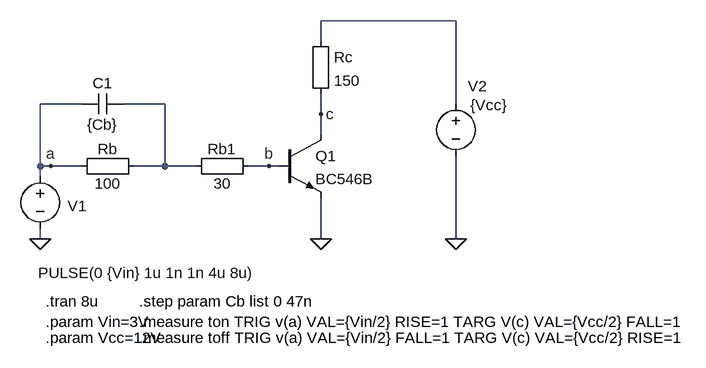
[diagram p0: schematic BJT-SWITCH-4.asc]
BJT-SWITCH-4.asc, the LTspice schematic file:
Version 4
SHEET 1 880 680
WIRE 416 -96 208 -96
WIRE 208 -64 208 -96
WIRE -160 32 -224 32
WIRE -32 32 -96 32
WIRE 416 32 416 -96
WIRE 208 48 208 16
WIRE 208 80 208 48
WIRE -224 128 -224 32
WIRE -208 128 -224 128
WIRE -160 128 -208 128
WIRE -32 128 -32 32
WIRE -32 128 -80 128
WIRE 16 128 -32 128
WIRE 128 128 96 128
WIRE 144 128 128 128
WIRE -224 144 -224 128
WIRE -224 240 -224 224
WIRE 208 240 208 176
WIRE 416 240 416 112
FLAG 208 240 0
FLAG -224 240 0
FLAG 416 240 0
FLAG -208 128 a
FLAG 208 48 c
FLAG 128 128 b
SYMBOL Misc\\EuropeanResistor 192 -80 R0
SYMATTR InstName Rc
SYMATTR Value 150
SYMBOL Misc\\EuropeanResistor -64 112 R90
WINDOW 0 5 56 VBottom 2
WINDOW 3 27 56 VTop 2
SYMATTR InstName Rb
SYMATTR Value 100
SYMBOL voltage -224 128 R0
WINDOW 3 -3 164 Left 2
WINDOW 123 0 0 Left 2
WINDOW 39 0 0 Left 2
WINDOW 0 42 61 Left 2
SYMATTR Value PULSE(0 {Vin} 1u 1n 1n 4u 8u)
SYMATTR InstName V1
SYMBOL voltage 416 16 R0
WINDOW 3 22 18 Left 2
WINDOW 123 0 0 Left 2
WINDOW 39 0 0 Left 2
WINDOW 0 18 -11 Left 2
SYMATTR Value {Vcc}
SYMATTR InstName V2
SYMBOL npn 144 80 R0
SYMATTR InstName Q1
SYMATTR Value BC546B
SYMBOL cap -96 16 R90
WINDOW 0 0 32 VBottom 2
WINDOW 3 32 32 VTop 2
SYMATTR InstName C1
SYMATTR Value {Cb}
SYMBOL Misc\\EuropeanResistor 112 112 R90
WINDOW 0 5 56 VBottom 2
WINDOW 3 27 56 VTop 2
SYMATTR InstName Rb1
SYMATTR Value 30
TEXT -216 336 Left 2 !.tran 8u
TEXT -216 368 Left 2 !.param Vin=3V
TEXT -72 392 Left 2 !.measure toff TRIG v(a) VAL={Vin/2} FALL=1 TARG V(c) VAL={Vcc/2} RISE=1
TEXT -216 392 Left 2 !.param Vcc=12V
TEXT -72 368 Left 2 !.measure ton TRIG v(a) VAL={Vin/2} RISE=1 TARG V(c) VAL={Vcc/2} FALL=1
TEXT -72 336 Left 2 !.step param Cb list 0 47n

The netlist it stands for:
* BJT-SWITCH-4.asc
Rc N001 c 150
Rb N002 a 100
V1 a 0 PULSE(0 {Vin} 1u 1n 1n 4u 8u)
V2 N001 0 {Vcc}
Q1 c b 0 0 BC546B
C1 N002 a {Cb}
Rb1 b N002 30
.model NPN NPN
.model PNP PNP
.lib standard.bjt
.tran 8u
.param Vin=3V
.measure toff TRIG v(a) VAL={Vin/2} FALL=1 TARG V(c) VAL={Vcc/2} RISE=1
.param Vcc=12V
.measure ton TRIG v(a) VAL={Vin/2} RISE=1 TARG V(c) VAL={Vcc/2} FALL=1
.step param Cb list 0 47n
.backanno
.end